# EAGLE design heart (EAGLE 9.6.2)
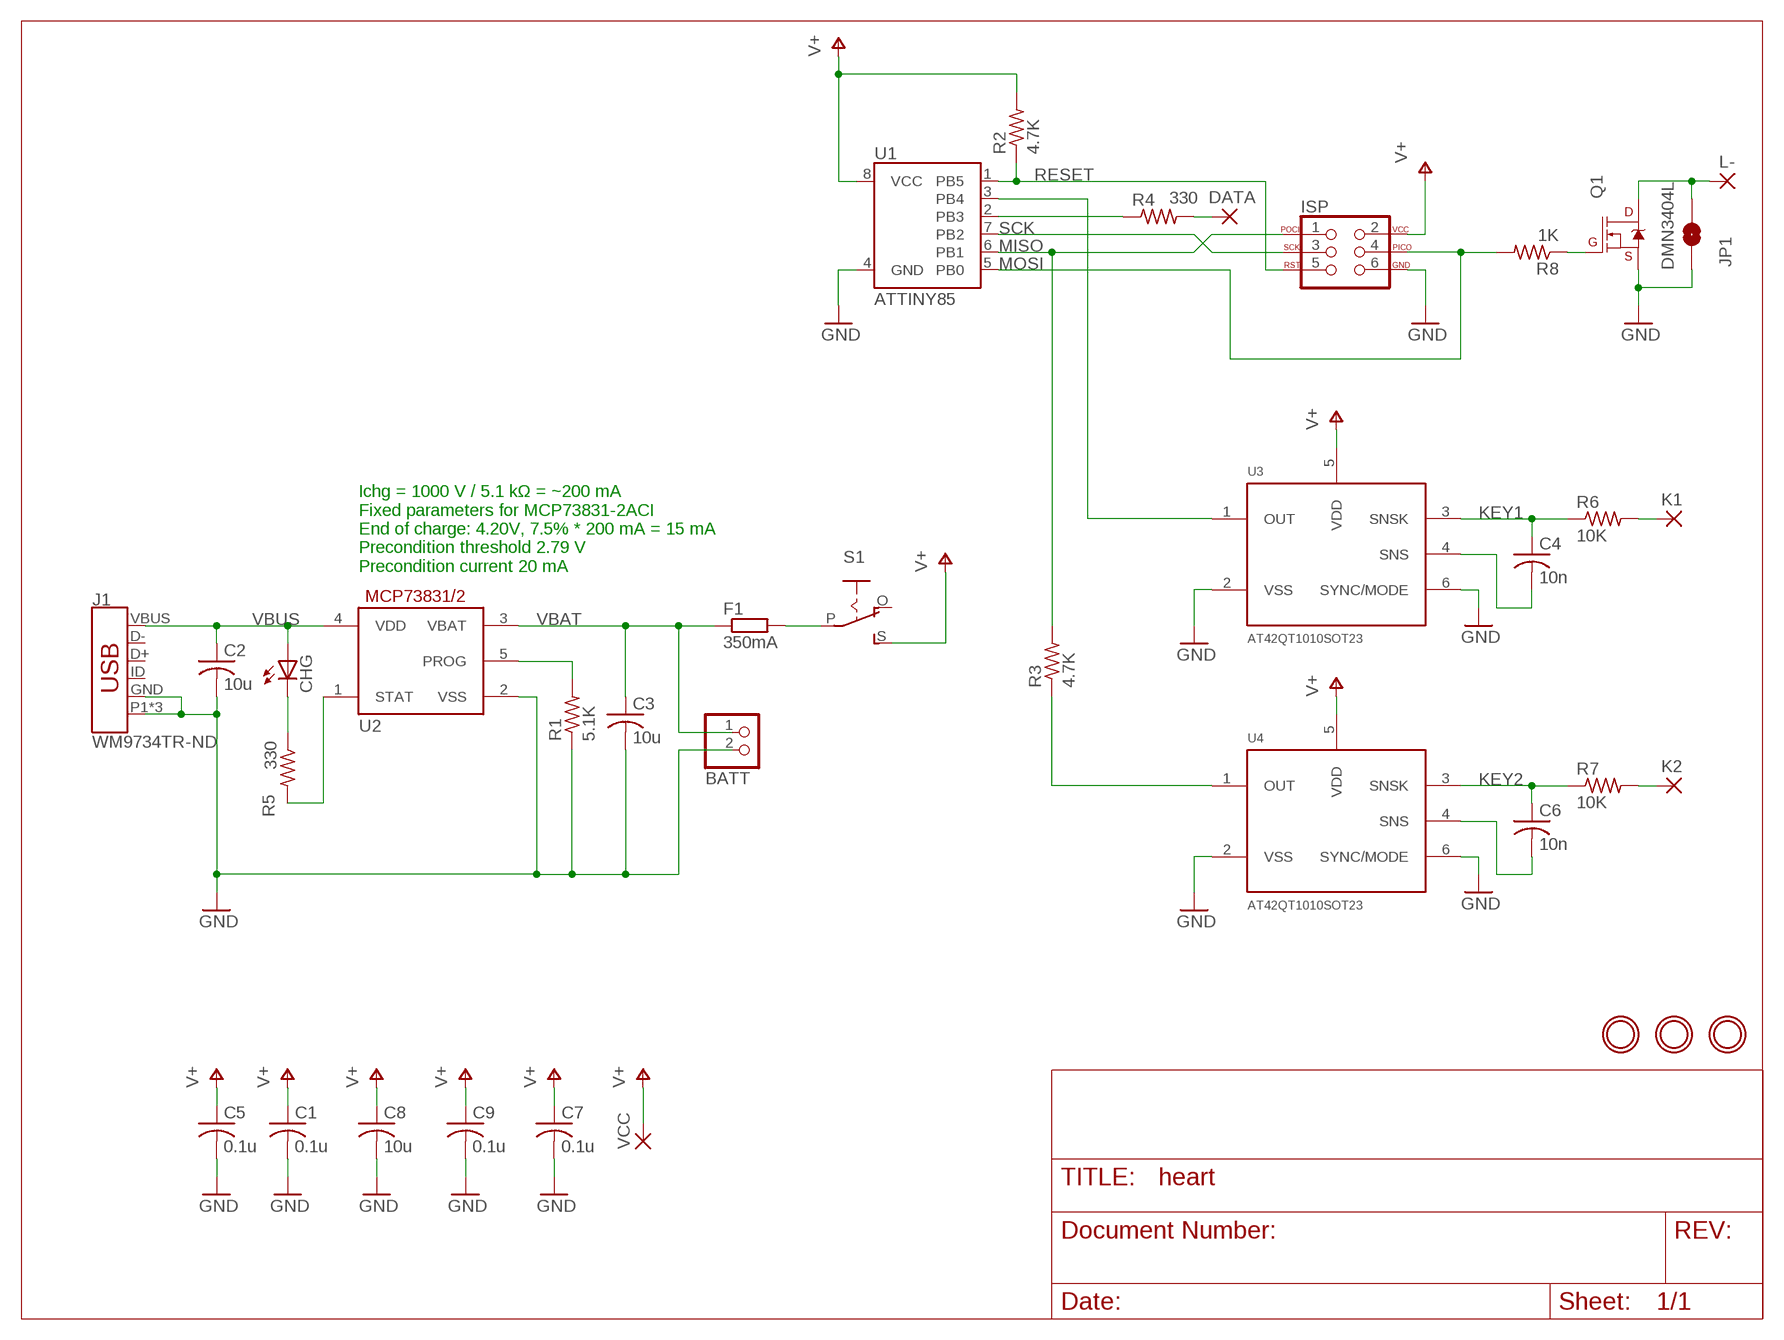
[diagram p0: schematic, sheet 1]

## Parts
BATT  JST_2PIN-THM-RA  [JST-PH-2-THM-RA]
C1  0.1u  C-USC0603  [C0603]
C2  10u  C-USC0603  [C0603]
C3  10u  C-USC0603  [C0603]
C4  10n  C-USC0603  [C0603]
C5  0.1u  C-USC0603  [C0603]
C6  10n  C-USC0603  [C0603]
C7  0.1u  C-USC0603  [C0603]
C8  10u  C-USC0603  [C0603]
C9  0.1u  C-USC0603  [C0603]
CHG  LEDCHIP-LED0805  [CHIP-LED0805]
DATA  2,15/1,0  [2,15/1,0]
F1  350mA  R-EU_R0603  [R0603]
ISP  AVR_SPI_PROG_3X2PTH  [2X3]
J1  WM9734TR-ND  USB_MICRO-B_FEMALE-SMT-VERT  [USB-B-MICRO-SMD_VERT]
JP1  JUMPER-SMT_2_NO_NO-SILK  [SMT-JUMPER_2_NO_NO-SILK]
K1  2,15/1,0  [2,15/1,0]
K2  2,15/1,0  [2,15/1,0]
L-  2,15/1,0  [2,15/1,0]
Q1  DMN3404L  MOSFET-NCH-AO3404A  [SOT23-3]
R1  5.1K  R-US_R0603  [R0603]
R2  4.7K  R-US_R0603  [R0603]
R3  4.7K  R-US_R0603  [R0603]
R4  330  R-US_R0603  [R0603]
R5  330  R-US_R0603  [R0603]
R6  10K  R-US_R0603  [R0603]
R7  10K  R-US_R0603  [R0603]
R8  1K  R-US_R0603  [R0603]
S1  EG1218S  [EG1218]
U1  ATTINY85  [ATTINY85]
U2  MCP73831/OT  [SOT23-5L]
U3  AT42QT1010SOT23  [SOT23-6]
U4  AT42QT1010SOT23  [SOT23-6]
U$1  MICROBUILDER_MOUNTINGHOLE2.0  [MICROBUILDER_MOUNTINGHOLE_2.0_PLATED]
U$2  MICROBUILDER_MOUNTINGHOLE2.0  [MICROBUILDER_MOUNTINGHOLE_2.0_PLATED]
U$4  MICROBUILDER_MOUNTINGHOLE2.0  [MICROBUILDER_MOUNTINGHOLE_2.0_PLATED]
VCC  1,6/0,9  [1,6/0,9]

## Nets
GND: BATT.2 C1.2 C2.2 C3.2 C5.2 C7.2 C8.2 C9.2 ISP.6 J1.GND J1.P1(SHIELD) J1.P2(SHIELD) J1.P3(SHIELD) JP1.1 Q1.2(S) R1.1 U1.4(GND) U2.2(VSS) U3.2(VSS) U3.6(SYNC/MODE) U4.2(VSS) U4.6(SYNC/MODE)
KEY1: C4.1 R6.1 U3.3(SNSK)
KEY2: C6.1 R7.1 U4.3(SNSK)
KOUT1: U1.3(PB4) U3.1(OUT)
KOUT2: R3.1 U4.1(OUT)
LED_DATA: DATA.1(P) R4.2
LED_PIN: R4.1 U1.2(PB3)
MISO: ISP.1 R3.2 U1.6(PB1)
MOSI: ISP.4 R8.2 U1.5(PB0)
N$1: F1.2 S1.P
N$2: K1.1(P) R6.2
N$3: K2.1(P) R7.2
N$4: C4.2 U3.4(SNS)
N$5: JP1.2 L-.1(P) Q1.3(D)
N$6: Q1.1(G) R8.1
N$7: CHG.C R5.1
N$11: C6.2 U4.4(SNS)
PROG: R1.2 U2.5(PROG)
RESET: ISP.5 R2.1 U1.1(PB5)
SCK: ISP.3 U1.7(PB2)
STAT: R5.2 U2.1(STAT)
V+: C1.1 C5.1 C7.1 C8.1 C9.1 ISP.2 R2.2 S1.S U1.8(VCC) U3.5(VDD) U4.5(VDD) VCC.1(P)
VBAT: BATT.1 C3.1 F1.1 U2.3(VBAT)
VBUS: C2.1 CHG.A J1.VBUS U2.4(VDD)
Unconnected: J1.D+ J1.D- J1.ID S1.O

## Notes on the sheet
- Ichg = 1000 V / 5.1 kΩ = ~200 mA
  Fixed parameters for MCP73831-2ACI
  End of charge: 4.20V, 7.5% * 200 mA = 15 mA
  Precondition threshold 2.79 V
  Precondition current 20 mA

## Library data of the parts
BATT = adafruit:JST_2PIN: JST 2-Pin Connectors of various flavors SMT-RA (S2B-PH-SM4) 4UConnector #17311 SMT (B2B-PH-SM4) THM-RA (S2B-PH) THM (B2B-PH)
C1-C9 = rcl:C-US: CAPACITOR, American symbol; SPICEPREFIX: C
CHG = adafruit:LED: LED OSRAM: - CHIPLED LG R971, LG N971, LY N971, LG Q971, LY Q971, LO R971, LY R971 LH N974, LH R974 LS Q976, LO Q976, LY Q976 LO Q996 - Hyper CHIPLED LW Q18S LB Q993, LB Q99A, LB R99A - SideLED LS A670, LO A670, LY A670, LG A670, LP A670 LB A673, LV A673, LT A673, LW A673 LH A674 LY A675 LS A676, LA A676, LO A676, LY A676, LW A676 LS A679, LY A679, LG A679 - Hyper Micro SIDELED® LS Y876, LA Y876, LO Y876, LY Y876 LT Y87S - SmartLED LW L88C, LW L88S LB L89C, LB L89S, LG L890 LS L89K, LO L89K, LY L89K LS L896, LA L896, LO L896, LY L896 - TOPLED LS T670, LO T670, LY T670, LG T670, LP T670 LSG T670, LSP T670, LSY T670, LOP T670, LYG T670 LG T671, LOG T671, LSG T671 LB T673, LV T673, LT T673, LW T673 LH T674 LS T676, LA T676, LO T676, LY T676, LB T676, LH T676, LSB T676, LW T676 LB T67C, LV T67C, LT T67C, LS T67K, LO T67K, LY T67K, LW E67C LS E67B, LA E67B, LO E67B, LY E67B, LB E67C, LV E67C, LT E67C LW T67C LS T679, LY T679, LG T679 LS T770, LO T770, LY T770, LG T770, LP T770 LB T773, LV T773, LT T773, LW T773 LH T774 LS E675, LA E675, LY E675, LS T675 LS T776, LA T776, LO T776, LY T776, LB T776 LHGB T686 LT T68C, LB T68C - Hyper Mini TOPLED® LB M676 - Mini TOPLED Santana® LG M470 LS M47K, LO M47K, LY M47K Source: http://www.osram.convergy.de/
DATA K1 K2 L- = wirepad:2,15/1,0: THROUGH-HOLE PAD
F1 = rcl:R-EU_: RESISTOR, European symbol; SPICEPREFIX: R
ISP = SparkFun-Connectors:AVR_SPI_PROG_3X2: AVR ISP 6 Pin This is the reduced ISP connector for AVR programming. Common on Arduino. This footprint will take up less PCB space and can be used with a 10-pin to 6-pin adapter such as SKU: BOB-08508 **Special note about "TEST_POINT" package. The stop mask is on the top side, so if you want your programming test points to be on the bottom of your board, make sure to place this package on the bottom side of the board. This also ensure that the orientation to program from the bottom side will be correct. SparkFun Products: SparkFun ISP Pogo Adapter <https://www.sparkfun.com/products/11591> - NS Tiny AVR Programmer <https://www.sparkfun.com/products/11801> -PTH
J1 = SparkFun-Connectors:USB_MICRO-B: USB Type Micro-B Connector Male/female and PTH/SMT variants SparkFun Products: SparkFun microB USB Breakout <https://www.sparkfun.com/products/12035> SparkFun USB microB Plug Breakout <https://www.sparkfun.com/products/10031> SparkFun ESP8266 Thing <https://www.sparkfun.com/products/13231>; PROD_ID: CONN-13534
JP1 = SparkFun-Jumpers:JUMPER-SMT_2_NO: Normally open jumper This jumper has two pads in close proximity to each other. Apply solder to close the connection. Round pads are easier to solder for beginners, but are a lot larger. SparkFun Product that uses the round pads: SparkFun EL Sequencer <https://www.sparkfun.com/products/12781>
Q1 = SparkFun-DiscreteSemi:MOSFET-NCH: N-channel MOSFETs Voltage controlled devices that allow control of high current outputs. SparkFun Products: SparkFun OpenScale <https://www.sparkfun.com/products/13261> SparkFun Digital Sandbox <https://www.sparkfun.com/products/12651> SparkFun Monster Moto Shield <https://www.sparkfun.com/products/10182> SparkFun MOSFET Power Controller <https://www.sparkfun.com/products/11214>; PROD_ID: TRANS-12988; VALUE: 5.8A/30V/35mΩ
R1-R8 = rcl:R-US_: RESISTOR, American symbol; SPICEPREFIX: R
S1 = adafruit:EG1218: SLIDING SWITCH 0.1" spacing through hole, vertical SPDT slide switch http://www.ladyada.net/library/pcb/eaglelibrary.html
U1 = SparkFun-IC-Microcontroller:ATTINY85; PROD_ID: IC-09092
U2 = adafruit:MCP73831: MCP73831/2 Miniature Single-Cell, Fully Integrated Li-Ion, Li-Polymer Charge Management Controllers. Nice and small simple lipoly charge controller, with adjustable current and status output (LED) http://www.ladyada.net/library/pcb/eaglelibrary.html
U3 U4 = SparkFun-Sensors:AT42QT1010: Atmel AT42QT1010 The AT42QT1010 (QT1010) is a digital burst mode charge-transfer (QT™) sensor that is capable of detecting nearproximityor touch, making it ideal for implementing touch controls.The QT1010 is designed specifically for human interfaces, like control panels, appliances, toys, lighting controls, or anywhere a mechanical switch or button may be found. It includes all hardware and signal processing functions necessary to provide stable sensing under a wide variety of changing conditions. Only a single low-cost capacitor is required for operation. Datasheet <http://www.atmel.com/images/Atmel-9541-AT42-QTouch-BSW-AT42QT1010_Datasheet.pdf> Sparkfun Products Sparkfun Capacitive Touch Breakout <https://www.sparkfun.com/products/12041> (SEN-12041)
U$1 U$2 U$4 = microB:MICROBUILDER_MOUNTINGHOLE: Mounting Hole For #2 screws (0.086"/2.18mm width, 0.094"/2.4mm hole) use 2.5mm; BOM: EXCLUDE
VCC = wirepad:1,6/0,9: THROUGH-HOLE PAD

## Board
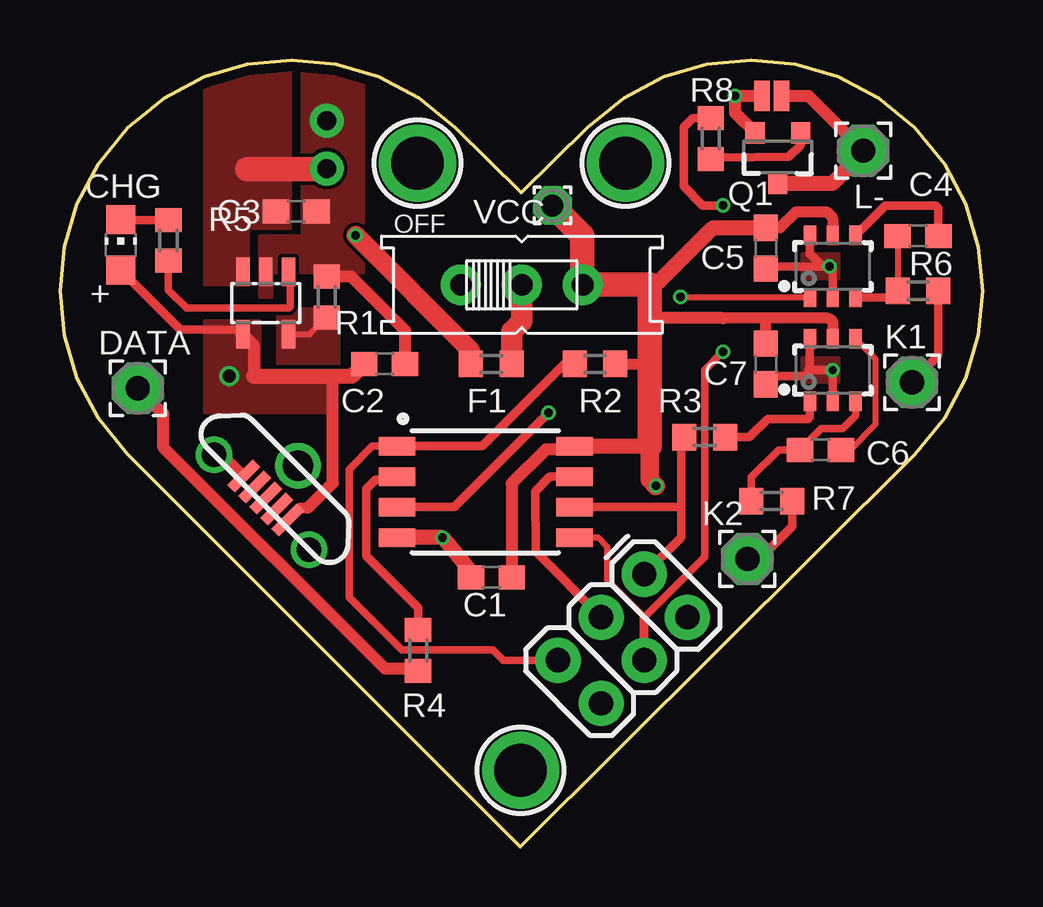
[diagram p1: board, top side]
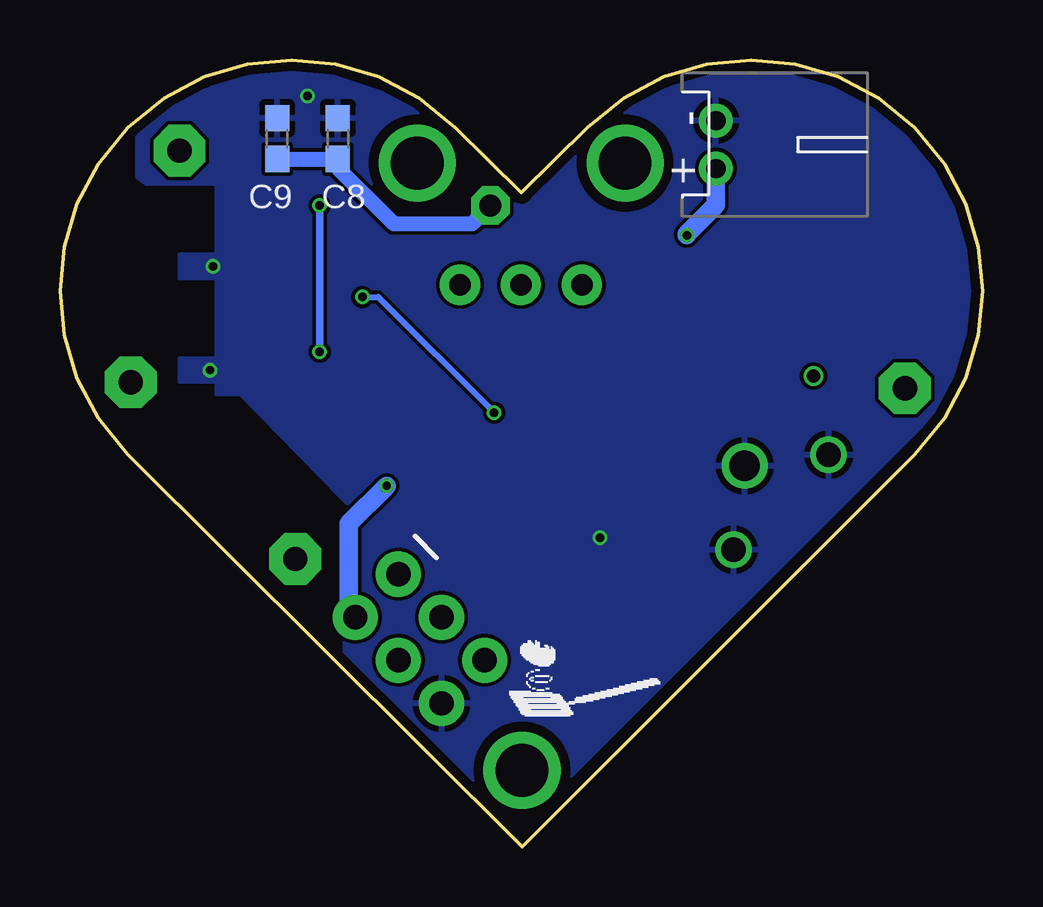
[diagram p2: board, bottom side, seen from below]

Size 38.44 x 32.81 mm. Coordinates in mm from the lower left corner, seen from the top.
Outline: 35.62,29.98 36.86,28.47 37.74,26.79 38.27,25.01 38.44,23.17 38.27,21.33 37.74,19.55 36.86,17.87 35.62,16.36 19.19,0 2.82,16.36 1.59,17.87 0.71,19.55 0.18,21.33 0,23.17 0.18,25.01 0.71,26.79 1.59,28.47 2.82,29.98 4.34,31.22 6.02,32.1 7.81,32.63 9.65,32.81 11.5,32.63 13.29,32.1 14.96,31.22 16.48,29.98 19.22,27.27 21.97,29.98 23.48,31.22 25.16,32.1 26.95,32.63 28.79,32.81 30.64,32.63 32.43,32.1 34.11,31.22 35.62,29.98
Copper layers (1*16): Top 0.035559375mm / dielectric 1.6mm / Bottom 0.035559375mm
Design rules "oshpark-2layer": minimum track width 6mil, minimum drill 10mil, track to track 6mil, track to pad 6mil, pad to pad 6mil, via to via 6mil, smd to smd 6mil, copper to edge 15mil, drill to drill 6mil, minimum pad ring 5mil, minimum via ring 5mil, stop-mask expansion 2.5mil, vias tented up to drill 0mil, thermal gap 10mil

### Footprints (pad centres in the part's own frame; a part is rotated, then mirrored left to right if it is on the bottom)
JST-PH-2-THM-RA = drill 0.8 pad 1.422: 1 1,0; 2 -1,0
C0603 = smd 1.1 x 1: 1 -0.85,0; 2 0.85,0
CHIP-LED0805 = smd 1.2 x 1.2: A 0,-1.05; C 0,1.05
2,15/1,0 = drill 1.016 pad 2.159 octagon: 1 0,0
R0603 = smd 1 x 1.1: 1 -0.85,0; 2 0.85,0
2X3 = drill 1.016 pad 1.88: 1 0,0; 2 0,2.54; 3 2.54,0; 4 2.54,2.54; 5 5.08,0; 6 5.08,2.54
USB-B-MICRO-SMD_VERT = smd 0.45 x 1.5: D+ 0,0; D- -0.65,0; GND 1.3,0; ID 0.65,0; VBUS -1.3,0 | drill 1.016: P1 -2.8,0.25; P2 2.8,0.25 | drill 1.27: P3 0,-1.9
SMT-JUMPER_2_NO_NO-SILK = smd 0.635 x 1.27: 1 -0.406,0; 2 0.406,0
SOT23-3 = smd 0.8 x 0.9: 1 -0.95,-1; 2 0.95,-1; 3 0,1.1
EG1218 = drill 0.9 pad 1.676: O -2.54,0; P 0,0; S 2.54,0
ATTINY85 = smd 1.524 x 0.762: 1 -3.683,1.905; 2 -3.683,0.635; 3 -3.683,-0.635; 4 -3.683,-1.905; 5 3.727,-1.905; 6 3.727,-0.635; 7 3.727,0.635; 8 3.727,1.905
SOT23-5L = smd 0.55 x 1.2: 1 -0.95,-1.3; 2 0,-1.3; 3 0.95,-1.3; 4 0.95,1.3; 5 -0.95,1.3
SOT23-6 = smd 0.51 x 0.8: 1 -0.95,-1.3; 2 0,-1.3; 3 0.95,-1.3; 4 0.95,1.3; 5 0,1.3; 6 -0.95,1.3
MICROBUILDER_MOUNTINGHOLE_2.0_PLATED = drill 2.2 pad 3: P$1 0,0
1,6/0,9 = drill 0.914 pad 1.6 octagon: 1 0,0

### Placement (x,y rotation side)
BATT  11.11,29.28 270 bottom
C1  17.97,11.24 180 top
C2  13.53,20.13 0 top
C3  9.84,26.48 0 top
C4  35.75,25.47 0 top
C5  29.4,24.96 270 top
C6  31.69,16.55 0 top
C7  29.4,20.13 270 top
C8  26.86,29.53 90 bottom
C9  29.4,29.53 90 bottom
CHG  2.53,25.1 0 top
DATA  3.24,19.12 0 top
F1  17.97,20.13 0 top
ISP  24.34,11.37 225 top
J1  8.57,14.54 135 top
JP1  29.66,31.31 0 top
K1  35.5,19.37 0 top
K2  28.64,12 0 top
L-  33.47,29.02 0 top
Q1  29.91,28.77 180 top
R1  11.11,22.93 270 top
R2  22.29,20.13 0 top
R3  26.86,17.08 180 top
R4  14.92,8.19 270 top
R5  4.52,25.28 270 top
R6  35.75,23.18 0 top
R7  29.66,14.42 0 top
R8  27.12,29.53 90 top
S1  19.24,23.43 0 top
U1  17.72,14.8 0 top
U2  8.57,22.67 180 top
U3  32.2,24.2 0 top
U4  32.2,19.88 0 top
U$1  14.9,28.5 0 top
U$2  23.56,28.5 0 top
U$4  19.19,3.19 0 top
VCC  20.51,26.74 0 top

### Tracks (layer width: path | path; a pad name or v marks a point on that pad's centre or on a via)
GND  (via drill 0.35)
  Top 0.254: C5.2 29.36,24.15 29.4,24.2 | 32.2,18.68 U4.2
  Top 0.356: U3.6 31.25,24.73 31.78,24.2 29.4,24.2 | v32.07,24.2 32.2,24.07 U3.2 | 32.2,18.68 v32.2,19.88 31.31,19.88 | C7.2 29.74,19.62 31.05,19.62 31.31,19.88 | 31.31,19.88 31.18,19.88 31.25,19.94 U4.6 | 17.12,11.46 C1.2
  Top 0.432: J1.GND 6.77,16.35 J1.P2
  Top 0.508: C2.2 14.38,21.53 12.13,23.78 R1.1 | Q1.2 28.13,30.6 v28.13,31.31 JP1.1
  Top 0.635: U1.4 v15.94,12.89 17.12,11.46
  pour Bottom: 19.24,0.83 19.5,0.83 26.61,7.94 26.61,13.02 25.91,13.71 30.93,18.86 31.94,18.86 31.94,27.62 34.87,27.62 35.24,27.9 35.24,30.29 32.13,32.02 28.03,32.48 27.88,32.32 27.62,32.32 23.05,30.8 19.5,27.24 14.16,32.58 7.64,32.58 5.22,31.51 3.24,30.24 0.95,26.99 0.45,24.2 0.45,22.16 1.21,18.86
  pour Top (no thermals): 10.1,32.83 10.1,25.47 8.32,25.47 8.32,22.93 8.83,22.93 8.83,23.94 12.64,23.94 12.64,32.83
  pour Bottom: 31.69,24.7 31.69,23.69 33.47,23.69 33.47,24.7
  pour Bottom: 31.94,20.39 31.94,19.37 33.47,19.37 33.47,20.39
  pour Top: 32.45,24.7 32.45,23.69 30.93,23.69 30.93,24.7
  pour Top: 32.45,20.39 32.45,19.37 30.93,19.37 30.93,20.39
KEY1
  Top 0.254: C4.1 R6.1 34.62,22.9
  Top 0.356: 34.62,22.9 U3.3
KEY2
  Top 0.305: U4.3 33.15,17.97 32.62,17.44 31.73,17.44 C6.1 29.95,16.55 28.81,15.41 R7.1
KOUT1  (via drill 0.35)
  Top 0.254: U3.1 25.88,22.9 v25.85,22.93
  Top 0.356: v20.36,18.1 16.42,14.16 U1.3
  Bottom 0.254: v25.85,22.93 25.18,22.93 v20.36,18.1
KOUT2
  Top 0.356: R3.1 28.73,17.08 29.49,17.85 31.18,17.85 31.25,17.91 U4.1
LED_DATA
  Top 0.305: 14.84,7.43 R4.2
  Top 0.508: 14.84,7.43 13.53,7.43 4.31,16.66 4.31,18.05 DATA.1
LED_PIN
  Top 0.254: U1.2 13.91,15.31
  Top 0.356: 13.91,15.31 13.15,15.31 12.77,14.92 12.77,12.13 14.92,9.97 R4.1
MISO
  Top 0.254: R3.2 25.88,16.95
  Top 0.356: 25.88,14.16 U1.6 | ISP.1 25.88,12.9 25.88,14.16 | 25.88,16.95 25.88,14.16
MOSI  (via drill 0.35)
  Top 0.279: ISP.4 24.28,7.84 24.28,9.64 22.8,11.12 22.8,12.51 22.42,12.89 U1.5
  Top 0.305: v27.62,20.64 26.86,19.88 26.86,12.09 24.34,9.57
  Top 0.356: 24.34,9.57 ISP.4 | v27.62,26.74 26.78,26.74 25.98,27.53 25.98,30.01 26.35,30.38 R8.2
  Bottom 0.305: v27.62,26.74 v27.62,20.64
N$1
  Top 0.889: S1.P 19.24,21.91 18.82,21.49 F1.2
N$2
  Top 0.356: K1.1 36.6,20.47 R6.2
N$3
  Top 0.356: R7.2 30.51,13.36 29.15,12 K2.1
N$4
  Top 0.254: 36.51,26.74 36.6,26.65
  Top 0.356: U3.4 34.39,26.74 36.51,26.74 | 36.6,26.65 C4.2
N$5
  Top 0.508: JP1.2 31.18,31.31 L-.1
  Top 0.635: 33.47,28.94 32.2,27.67 Q1.3
  Top 0.762: L-.1 33.47,28.94
N$6
  Top 0.356: R8.1 27.52,28.73 30.37,28.77 30.86,29.26 Q1.1
N$7
  Top 0.356: R5.1 2.55,26.13 CHG.C
N$11
  Top 0.254: U4.4 33.97,20.35 33.97,17.61 32.92,16.55 C6.2
PROG
  Top 0.254: U2.5 10.41,21.37 R1.2
  pour Top (no thermals): 11.62,22.42 9.08,22.42 9.08,20.13 11.62,20.13
RESET
  Top 0.305: ISP.5 18.47,7.78 18.03,8.21 14.24,8.21 12.05,10.4 12.05,15.73 13.02,16.7 U1.1
  Top 0.356: R2.1 21.02,20.13 17.59,16.7 U1.1
SCK
  Top 0.356: ISP.3 19.81,12.31 19.81,14.82 20.41,15.43 U1.7
STAT
  Top 0.254: U2.1 9.59,23.91 | 9.59,22.51 9.53,22.45
  Top 0.305: 9.59,23.91 9.59,22.51 | 9.53,22.45 5.28,22.45 4.52,23.22 R5.2
V+  (via drill 0.35)
  Top 0.254: 21.57,16.58 U1.8
  Top 0.356: 24.58,16.58 21.57,16.58 | U1.8 21.32,16.58
  Top 0.457: U4.5 32.2,21.91 32.01,22.04 29.4,22.04 | R2.2 24.58,20.13 | 29.4,22.04 27.62,22.04 | C7.1 29.4,22.04 | C5.1 30,25.81 30.67,26.48 31.94,26.48 32.2,26.23 U3.5
  Top 0.508: 21.32,16.58 20.26,16.58 18.82,15.14 C1.1 | 27.62,22.04 24.7,22.04 24.58,22.16
  Top 0.635: U1.8 24.58,16.7 | 24.58,23.43 24.83,23.43 27.2,25.81 C5.1
  Top 0.762: v24.83,15.05 24.58,15.31 24.58,16.58
  Top 0.889: VCC.1
  Top 1.016: 24.58,16.7 24.58,20.13 24.58,22.16 24.58,23.43 S1.S 21.77,23.45 21.77,25.48 VCC.1
  Bottom 0.635: VCC.1 21.27,25.97 24.54,25.97 26.86,28.3 C8.1 C9.1
  Bottom 0.762: v24.83,15.05 26.4,13.48 26.4,9.84 ISP.2
VBAT  (via drill 0.35)
  Top 0.762: F1.1 17.12,20.7 v12.32,25.5
  Top 1.016: BATT.1 11.1,28.26 7.81,28.26
  Bottom 0.762: v12.32,25.5 12.32,25.55 11.11,26.75 BATT.1
  pour Top (no thermals): 9.59,33.09 6.03,33.09 6.03,23.43 7.84,23.43 7.84,25.8 9.59,25.8
VBUS  (via drill 0.55)
  Top 0.356: 7.56,21.31 U2.4 | CHG.A 5.02,21.56 7.56,21.56
  Top 0.432: J1.VBUS 10,14.13 10.32,14.13
  Top 0.508: U2.4 8.07,20.93 8.07,19.62 | 7.56,21.31 7.56,21.56 | 10.32,14.13 11.37,15.18 11.37,19.62
  Top 0.635: C2.1 12.17,19.62 11.37,19.62 8.07,19.62
  other vias: 7.05,19.62
  pour Top (no thermals): 6.03,21.91 8.32,21.91 8.32,19.62 11.37,19.62 11.37,18.1 6.03,18.1

### Text on the board
tPlace: OFF